# EAGLE design v2.0 Power (EAGLE 9.7.0)
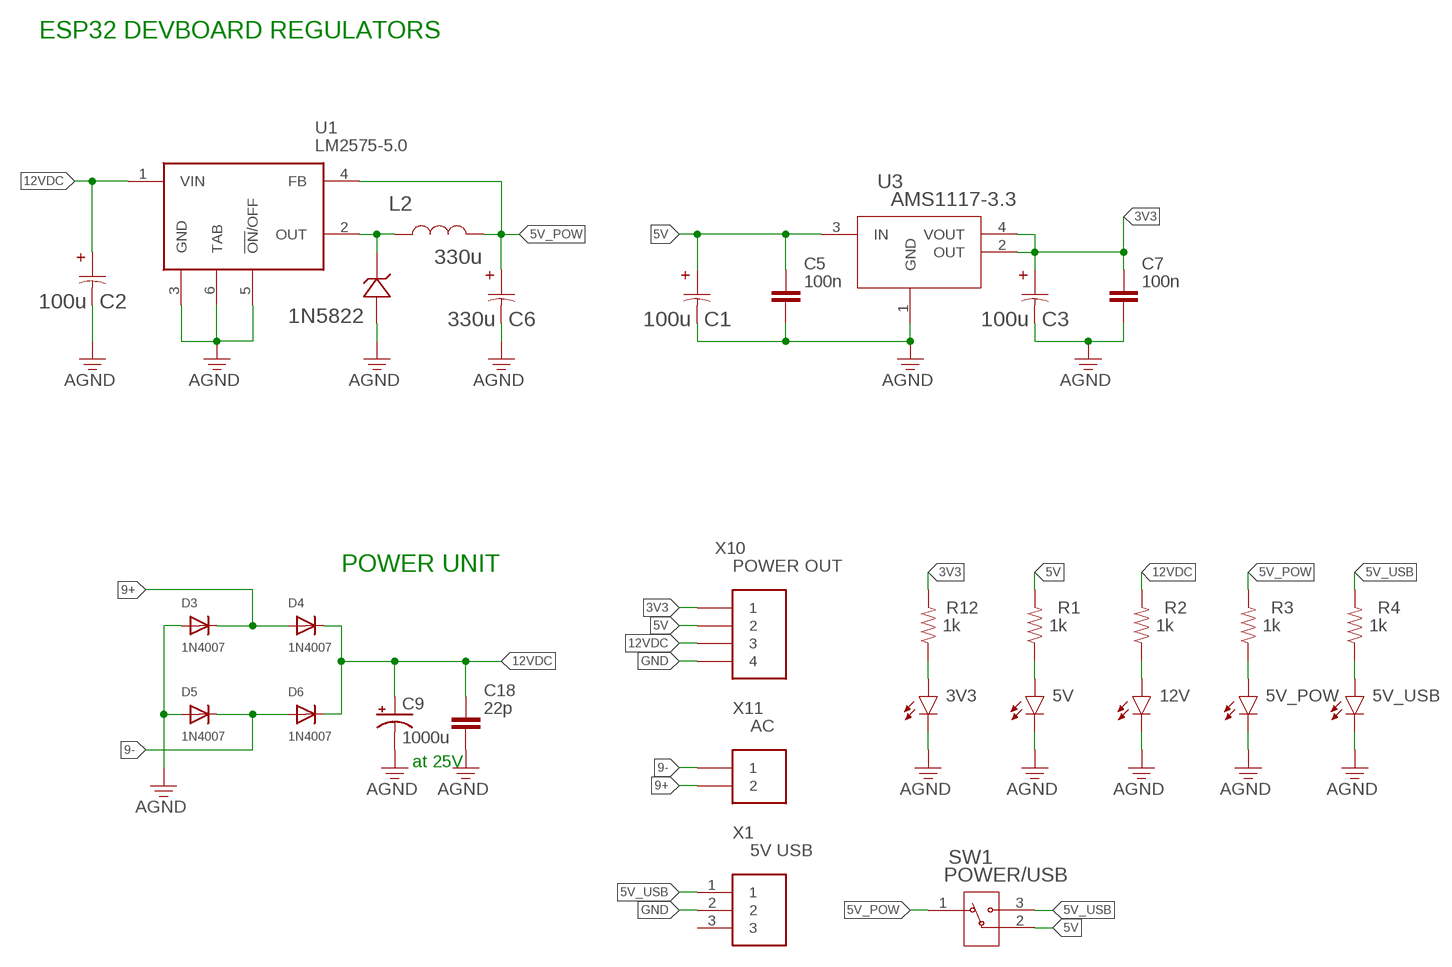
[diagram p0: schematic, sheet 1]

## Parts
1N5822  1N5822DO-201AD_STM  [1N5822]
3V3  LED  CHIP-FLAT-B_0805  [LEDC2012X110N_FLAT-B]
5V  LED  CHIP-FLAT-B_0805  [LEDC2012X110N_FLAT-B]
5V_POW  LED  CHIP-FLAT-B_0805  [LEDC2012X110N_FLAT-B]
5V_USB  LED  CHIP-FLAT-B_0805  [LEDC2012X110N_FLAT-B]
12V  LED  CHIP-FLAT-B_0805  [LEDC2012X110N_FLAT-B]
C1  100u  100UF_CAPCAP_YX_6P3X11_RUB  [100UF_CAP]
C2  100u  100UF_CAPCAP_YX_6P3X11_RUB  [100UF_CAP]
C3  100u  100UF_CAPCAP_YX_6P3X11_RUB  [100UF_CAP]
C5  100n  C_CHIP-0805(2012-METRIC)  [CAPC2012X110]
C6  330u  330UF_CAPCAP_YX_10X12P5_RUB  [CAP_YX_10X12P5_RUB]
C7  100n  C_CHIP-0805(2012-METRIC)  [CAPC2012X110]
C9  1000u  CAP_10X20INCAP_10X20IN  [CAP_10X20IN]
C18  22p  C_CHIP-0805(2012-METRIC)  [CAPC2012X110]
D3  1N4007  DIODE_SOD-123FL  [SOD-123FL]
D4  1N4007  DIODE_SOD-123FL  [SOD-123FL]
D5  1N4007  DIODE_SOD-123FL  [SOD-123FL]
D6  1N4007  DIODE_SOD-123FL  [SOD-123FL]
L2  330u  330UH_INDIND_IFDC2525DZ_VIS  [IND_IFDC2525DZ_VIS]
R1  1k  R-US_CHIP-0805(2012-METRIC)  [RESC2012X65]
R2  1k  R-US_CHIP-0805(2012-METRIC)  [RESC2012X65]
R3  1k  R-US_CHIP-0805(2012-METRIC)  [RESC2012X65]
R4  1k  R-US_CHIP-0805(2012-METRIC)  [RESC2012X65]
R12  1k  R-US_CHIP-0805(2012-METRIC)  [RESC2012X65]
SW1  POWER/USB  SL_SWITCHSS-12D10G5_XKB  [SS-12D10G5_XKB]
U1  LM2575-5.0  [MICROCHIP_TO-263]
U3  AMS1117-3.3  AMS1117-3.3_ADS-L  [_ADS-L]
X1  5V USB  JST-XH-03-PIN-LONG-PAD  [JST-XH-03-PACKAGE-LONG-PAD]
X10  POWER OUT  JST-XH-04-PIN-LONG-PAD  [JST-XH-04-PACKAGE-LONG-PAD]
X11  AC  JST-XH-02-PIN-LONG-PAD  [-LONG-PAD]

## Nets
3V3: C3.1 C7.1 R12.2 U3.2(OUT) U3.4(VOUT) X10.1
5V: C1.1 C5.1 R1.2 SW1.2 U3.3(IN) X10.2
5V_POW: C6.1 L2.1 R3.2 SW1.1 U1.4(FB)
5V_USB: R4.2 SW1.3 X1.1
9+: D3.C D4.A X11.2
9-: D5.C D6.A X11.1
12VDC: C2.1 C9.1(+) C18.1 D4.C D6.C R2.2 U1.1(VIN) X10.3
GND: 1N5822.2 3V3.C 5V.C 5V_POW.C 5V_USB.C 12V.C C1.2 C2.2 C3.2 C5.2 C6.2 C7.2 C9.2(-) C18.2 D3.A D5.A U1.3(GND) U1.5(!ON!/OFF) U1.6(TAB) U3.1(GND) X1.2 X10.4 ; supply symbol labelled AGND
N$1: 5V.A R1.1
N$2: 1N5822.1 L2.2 U1.2(OUT)
N$3: 12V.A R2.1
N$4: 5V_POW.A R3.1
N$5: 5V_USB.A R4.1
N$6: 3V3.A R12.1
Unconnected: X1.3

## Notes on the sheet
- ESP32 DEVBOARD REGULATORS
- POWER UNIT
- at 25V

## Library data of the parts
1N5822 = SD-SolderSync-Library:1N5822; COPYRIGHT: Copyright (C) 2025 Ultra Librarian. All rights reserved.; MANUFACTURER_PART_NUMBER: 1N5822; MFR_NAME: STMicroelectronics
3V3 5V 5V_POW 5V_USB 12V = LED:CHIP-FLAT-B: Blue LED - Generic; CATEGORY: LED; COLOR: Blue; DESCRIPTION: Blue LED Indication 0805 (2012 Metric); PACKAGE_SIZE: 0805; PACKAGE_TYPE: SMD; SUBCATEGORY: Chip LED; TYPE: Square with Flat Top
C1-C3 = SD-SolderSync-Library:100UF_CAP; COPYRIGHT: Copyright (C) 2025 Ultra Librarian. All rights reserved.; MANUFACTURER_PART_NUMBER: 35ZLH100MEFC6.3X11; MFR_NAME: Rubycon
C5 C7 C18 = Capacitor:C: Capacitor - Generic; CATEGORY: Capacitor; PACKAGE_SIZE: 0805; PACKAGE_TYPE: SMD; SUBCATEGORY: Ceramic Capacitors; TYPE: MLCC
C6 = SD-SolderSync-Library:330UF_CAP; COPYRIGHT: Copyright (C) 2025 Ultra Librarian. All rights reserved.; MANUFACTURER_PART_NUMBER: 35ZLH330MEFCT810X12.5; MFR_NAME: Rubycon
C9 = SD-SolderSync-Library:CAP_10X20IN; COPYRIGHT: Copyright (C) 2025 Ultra Librarian. All rights reserved.; MANUFACTURER_PART_NUMBER: UVR1E102MPD; MFR_NAME: Nichicon
D3-D6 = adafruit:DIODE: Diode SMADIODE - SMA Surface Mount Package 20V 1A Schottky Diode Digikey: 641-1014-6-ND DO-1N4148 - Through Hole Small Current Diode SOD-123 20V 1 A (.5mV Vf) Schottky Diode - Digikey: MBRX120TPMSCT-ND SOD-323 10V 570mA (.38mV Vf, 3ns) Schottky Diode - Digikey: ZLLS410CT-ND SOD-523 30V 30mA Schottky Diode (RB751S-40TE61) - Digikey: RB751S-40TE61CT-ND SOT23-R/W - SOT23 Package (R = Solder Paste/Reflow Ovens, W = Hand-Soldering) BAT54Film 40V 300mA - Digikey: 497-7162-1-ND
L2 = SD-SolderSync-Library:330UH_IND; COPYRIGHT: Copyright (C) 2025 Ultra Librarian. All rights reserved.; MANUFACTURER_PART_NUMBER: IFDC2525DZER331M; MFR_NAME: Vishay
R1-R4 R12 = Resistor:R-US: Resistor Fixed - ANSI; CATEGORY: Resistors; DESCRIPTION: Chip Resistor 2.00 X 1.25 X 0.65 mm body 0805(2012-METRIC) Package; PACKAGE_SIZE: 0805; PACKAGE_TYPE: SMD
SW1 = SD-SolderSync-Library:SL_SWITCH; COPYRIGHT: Copyright (C) 2025 Ultra Librarian. All rights reserved.; MANUFACTURER_PART_NUMBER: SS-12D10G5; MFR_NAME: XKB Connectivity
U1 = SD-SolderSync-Library:LM2575-5.0: Microchip LM2575-5.0WU, Inverting, Step Down DC-DC Converter, 1A, 6-Pin TO-263 Source: Datasheet <http://ww1.microchip.com/downloads/en/DeviceDoc/lm2575.pdf>; DESCRIPTION: Microchip LM2575-5.0WU, Inverting, Step Down DC-DC Converter, 1A, 6-Pin TO-263; HEIGHT: mm; MANUFACTURER_NAME: Microchip; MANUFACTURER_PART_NUMBER: LM2575-5.0WU; MOUSER_PART_NUMBER: 998-LM2575-5.0WU; MOUSER_PRICE-STOCK: https://www.mouser.co.uk/ProductDetail/Microchip-Technology/LM2575-5.0WU?qs=kh6iOki%2FeLGUJkdNakLUEw%3D%3D
U3 = SD-SolderSync-Library:AMS1117-3.3; COPYRIGHT: Copyright (C) 2024 Ultra Librarian. All rights reserved.; MANUFACTURER_PART_NUMBER: AMS1117-3.3; MFR_NAME: Advanced Monolithic Systems
X1 = Connectors:JST-XH-03-PIN: JST XH Connector 2 Pin Wire to board connector. Pitch: 2,54 mm, (0.100") Number of pins: 3 Created by Rembrandt Electronics www.rembrandtelectronics.com
X10 = Connectors:JST-XH-04-PIN: JST XH Connector 2 Pin Wire to board connector. Pitch: 2,54 mm, (0.100") Number of pins: 4 Created by Rembrandt Electronics www.rembrandtelectronics.com
X11 = Connectors:JST-XH-02-PIN: JST XH Connector 2 Pin Wire to board connector. Pitch: 2,54 mm, (0.100") Number of pins: 2 Created by Rembrandt Electronics www.rembrandtelectronics.com

## Board
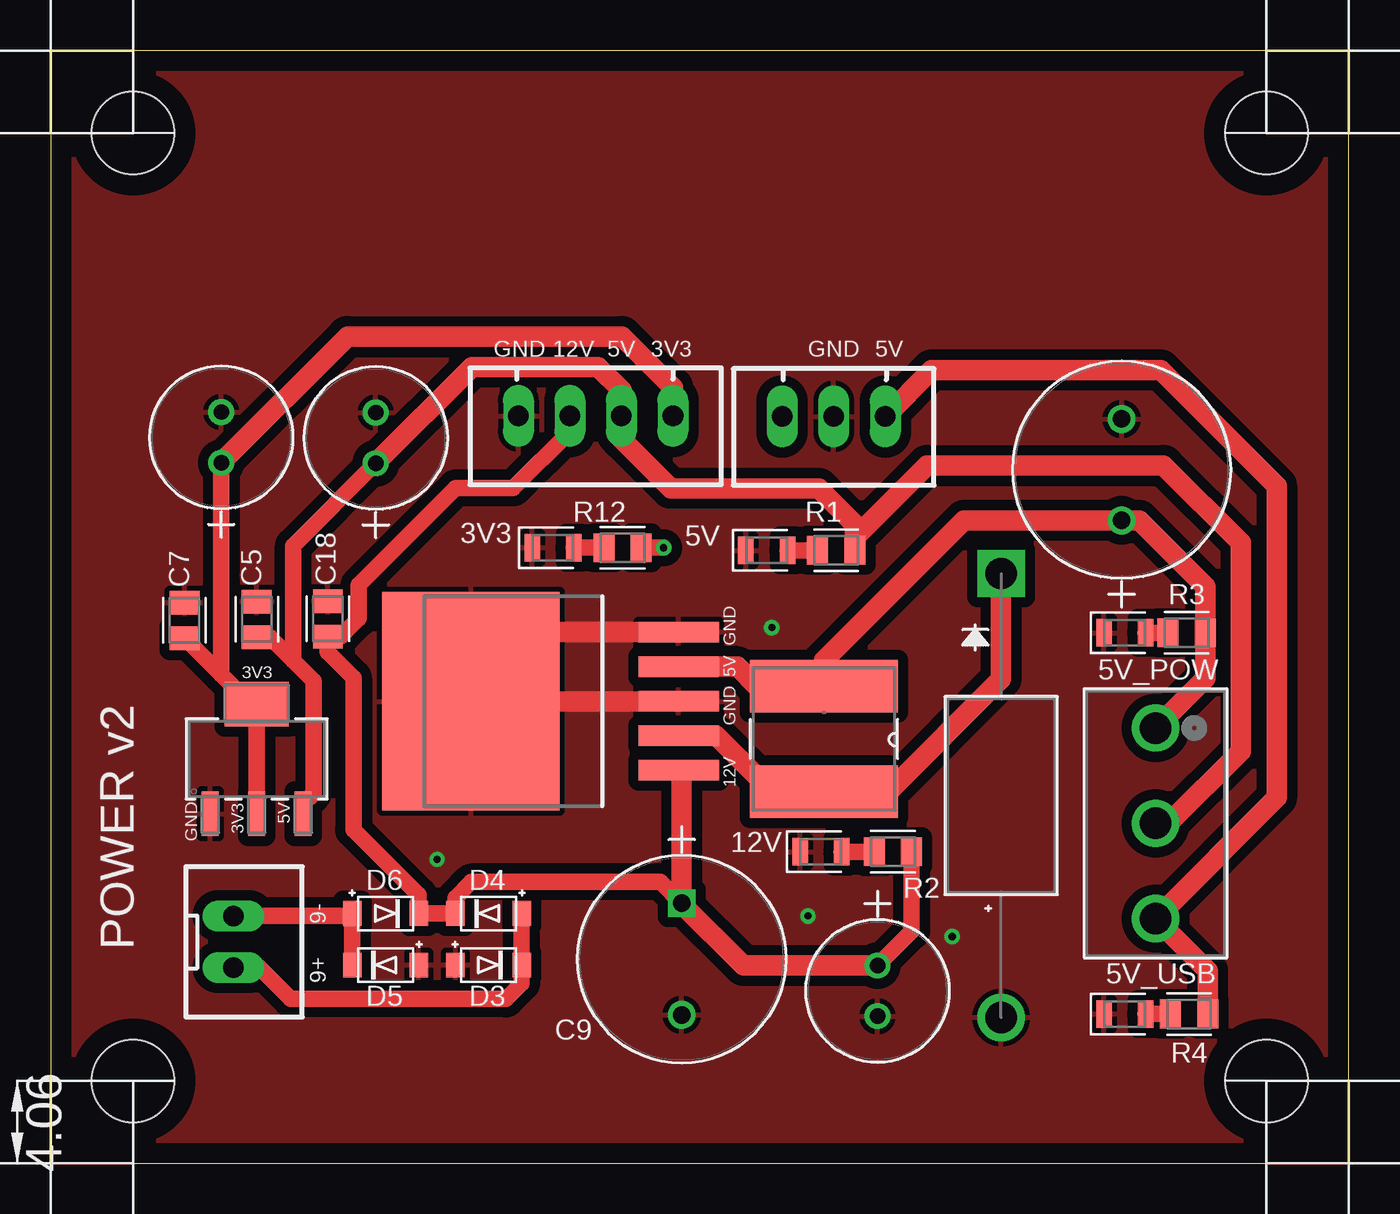
[diagram p1: board, top side]
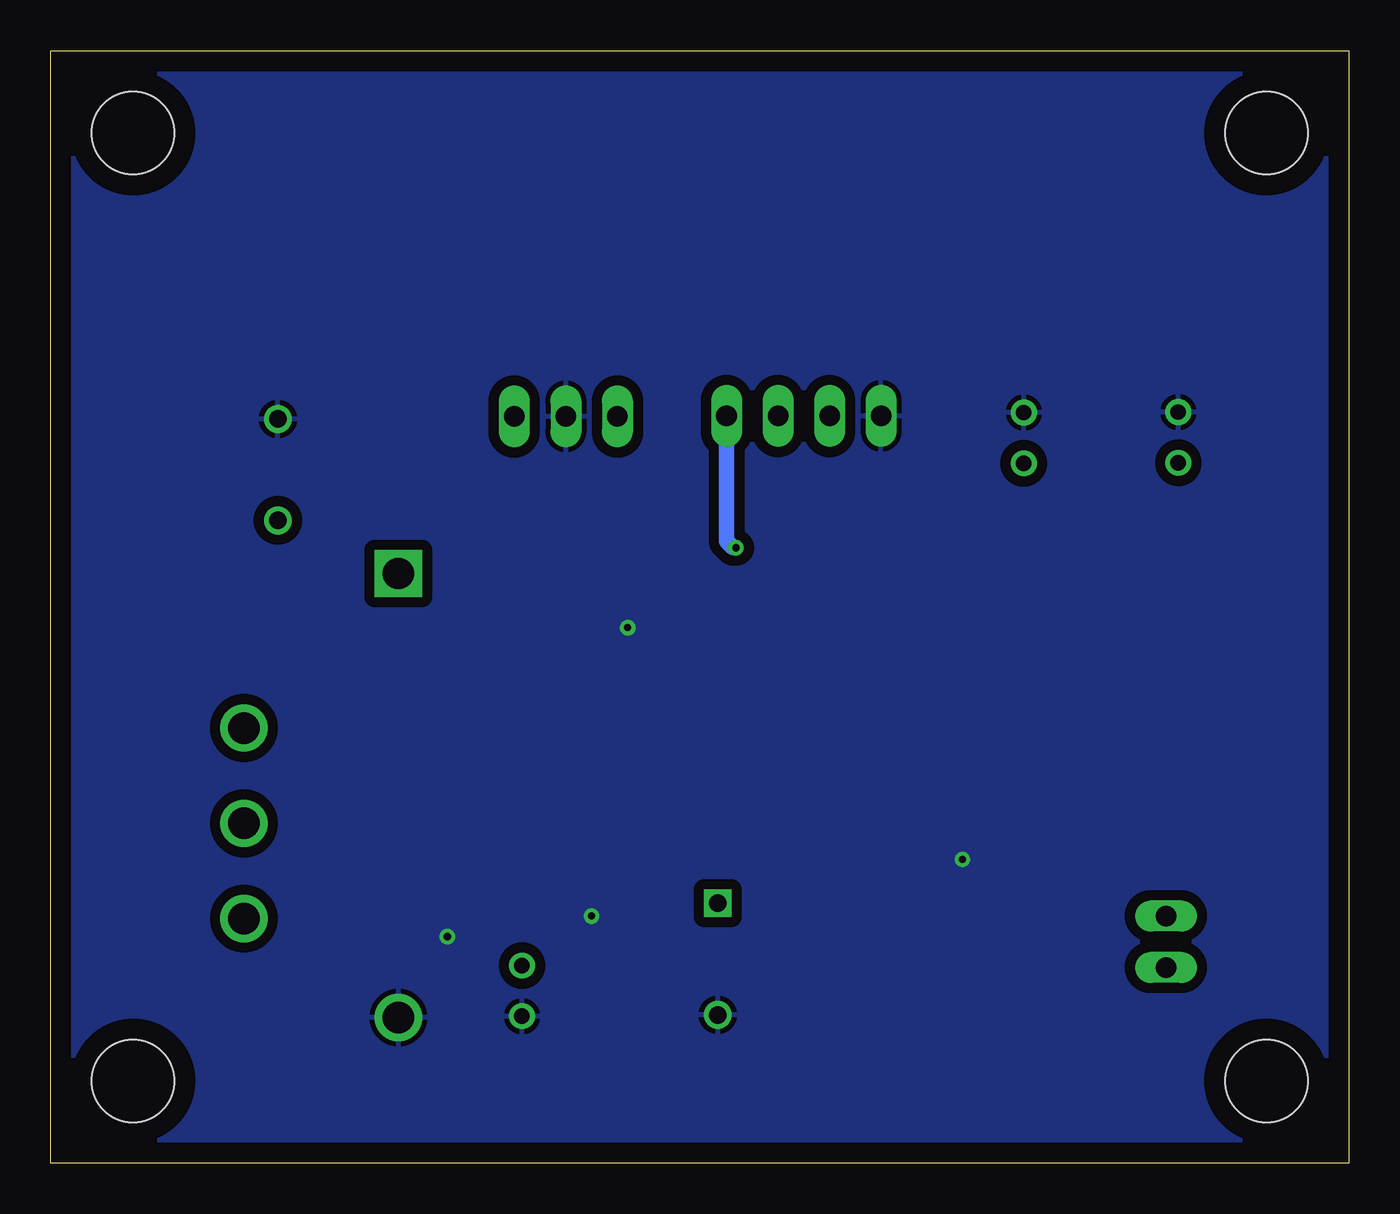
[diagram p2: board, bottom side, seen from below]

Size 64.01 x 54.86 mm. Coordinates in mm from the lower left corner, seen from the top.
Outline: 0,0 64.01,0 64.01,54.86 0,54.86 0,0
Copper layers (1*16): Top 0.035mm / dielectric 1.5mm / Bottom 0.035mm
Design rules "Fusion Electronics Design Rules": minimum track width 6mil, minimum drill 0.35mm, track to track 6mil, track to pad 6mil, pad to pad 6mil, via to via 6mil, smd to smd 6mil, copper to edge 40mil, drill to drill 6mil, minimum pad ring 10mil, minimum via ring 8mil, stop-mask expansion 4mil, vias tented up to drill 0mil, thermal gap 10mil
Holes 4.06 mm at 4.06,4.06 59.94,4.06 4.06,50.8 59.94,50.8

### Footprints (pad centres in the part's own frame; a part is rotated, then mirrored left to right if it is on the bottom)
1N5822 = drill 1.549 pad 2.057 square: 1 0,0 | drill 1.549 pad 2.057: 2 21.895,0
LEDC2012X110N_FLAT-B = smd 0.762 x 1.362: A 1.025,0; C -1.025,0
100UF_CAP = drill 0.762 pad 1.27: 1 0,0; 2 2.5,0
CAPC2012X110 = smd 1.165 x 1.465: 1 -0.875,0; 2 0.875,0
CAP_YX_10X12P5_RUB = drill 0.864 pad 1.372: 1 0,0; 2 5,0
CAP_10X20IN = drill 0.864 pad 1.372 square: 1 0,0 | drill 0.864 pad 1.372: 2 5.512,0
SOD-123FL = smd 0.91 x 1.22: A 1.637,0; C -1.637,0
IND_IFDC2525DZ_VIS = smd 2.591 x 7.29: 1 -2.6,0; 2 2.6,0
RESC2012X65 = smd 1.031 x 1.42: 1 -0.919,0; 2 0.919,0
SS-12D10G5_XKB = drill 1.549 pad 2.057: 1 0,0; 2 4.699,0; 3 9.398,0
MICROCHIP_TO-263 = smd 3.95 x 1: 1 -12.529,3.404; 2 -12.529,1.702; 3 -12.529,0; 4 -12.529,-1.702; 5 -12.529,-3.404 | smd 8.75 x 10.75: 6 -2.279,0
_ADS-L = smd 0.838 x 2.184: 1 -2.29,-2.705; 2 0,-2.705; 3 2.29,-2.705 | smd 3.15 x 2.184: 4 0,2.705
JST-XH-03-PACKAGE-LONG-PAD = drill 1.016 long: 1 -2.54,0; 2 0,0; 3 2.54,0
JST-XH-04-PACKAGE-LONG-PAD = drill 1.016 long: 1 -3.81,0; 2 -1.27,0; 3 1.27,0; 4 3.81,0
-LONG-PAD = drill 1.016 long: 1 -1.27,0; 2 1.27,0

### Placement (x,y rotation side)
1N5822  46.86,29.08 270 top
3V3  24.77,30.35 0 top
5V  35.31,30.23 0 top
5V_POW  52.96,26.16 0 top
5V_USB  52.96,7.37 0 top
12V  37.97,15.37 0 top
C1  16.03,34.52 90 top
C2  40.77,9.75 270 top
C3  8.41,34.54 90 top
C5  10.16,26.82 90 top
C6  52.81,31.7 90 top
C7  6.6,26.77 90 top
C9  31.11,12.83 270 top
C18  13.67,26.85 90 top
D3  21.59,9.78 180 top
D4  21.59,12.32 0 top
D5  16.51,9.78 0 top
D6  16.51,12.32 180 top
L2  38.13,20.92 270 top
R1  38.73,30.23 0 top
R2  41.53,15.37 0 top
R3  56.01,26.16 0 top
R4  56.13,7.37 0 top
R12  28.19,30.35 0 top
SW1  54.48,21.46 270 top
U1  18.44,22.79 180 top
U3  10.16,19.94 0 top
X1  38.61,36.83 180 top
X10  26.87,36.86 180 top
X11  9.02,10.92 270 top

### Tracks (layer width: path | path; a pad name or v marks a point on that pad's centre or on a via)
3V3  (via drill 0.35)
  Top 0.813: U3.2 U3.4 9.86,22.64 8.41,24.09 | 8.41,24.09 C7.1 | C3.1 8.41,24.09 | R12.2 v30.23,30.35
  Top 1.016: C3.1 14.63,40.77 28.17,40.77 30.68,38.25 X10.1
  Bottom 0.762: X10.1 30.68,30.68 30.35,30.35 v30.23,30.35
5V
  Top 0.813: 11.96,24.78 12.96,23.78 12.96,18.25 12.45,17.74 U3.3 | 11.96,24.78 10.8,25.95 C5.1 | 11.96,24.78 11.96,30.45 C1.1
  Top 1.016: C1.1 20.78,39.27 27,39.27 28.14,38.12 X10.2 28.14,35.71 30.58,33.27 37.88,33.27 39.65,31.5 39.65,30.86 | 39.65,30.86 43.21,34.42 54.86,34.42 58.67,30.61 58.67,20.32 55.12,16.76 SW1.2 | R1.2 39.65,30.86
5V_POW
  Top 1.016: U1.4 33.86,24.49 34.82,23.52 L2.1 38.12,24.79 45.03,31.7 C6.1 53.67,31.7 56.93,28.45 R3.2 56.93,23.91 SW1.1
5V_USB
  Top 1.016: R4.2 57.05,9.5 SW1.3 60.45,18.03 60.45,33.4 54.74,39.12 43.43,39.12 X1.1
9+
  Top 0.813: D4.A D3.C 23.23,8.88 22.45,8.1 11.84,8.1 10.29,9.65 X11.2
9-
  Top 0.813: D5.C D6.A 14.75,12.19 X11.1
12VDC
  Top 0.813: C9.1 30.07,13.87 20.74,13.87 19.95,13.08 D4.C D6.C 18.15,13.23 14.93,16.45 14.93,23.94 13.66,25.21 C18.1 14.3,25.97 15.19,26.86 15.19,28.51 19.98,33.3 22.81,33.3 25.6,36.09 X10.3 | R2.2 42.45,11.43 C2.1
  Top 1.016: U1.1 31.11,19.24 C9.1 31.11,12.8 34.16,9.75 C2.1
GND  (via drill 0.35)
  Top 0.254: D5.A 18.46,9.78 18.5,9.83 | 19.6,9.83 19.64,9.78 D3.A
  Top 1.016: U1.5 23.75,26.19 | 23.75,26.19 20.72,23.16 U1.6 U1.3 | 23.75,26.2 23.75,26.19
  other vias: 19.05,14.99 35.56,26.42 44.45,11.18 37.34,12.19
  pour Top (isolate 0.508): -1.14,-1.14 65.96,-1.14 65.96,56.01 -1.14,56.01
  pour Bottom (isolate 0.508): -2.41,-2.41 67.34,-2.41 67.34,57.66 -2.41,57.66
N$1
  Top 0.813: R1.1 5V.A
N$2
  Top 1.016: U1.2 32.82,21.08 35.59,18.32 L2.2 41.3,18.32 46.86,23.88 1N5822.1
N$3
  Top 0.813: 12V.A R2.1
N$4
  Top 0.813: 5V_POW.A R3.1
N$5
  Top 0.813: 5V_USB.A R4.1
N$6
  Top 0.813: 3V3.A R12.1

### Text on the board
tPlace: GND | 12V | 5V | 3V3 | GND | 5V | GND | 3V3 | 5V | POWER v2 | GND | 12V | 3V3 | 5V | GND | 9- | 9+